# EAGLE design Stim+EMG-A2530 (EAGLE 7.1.0)
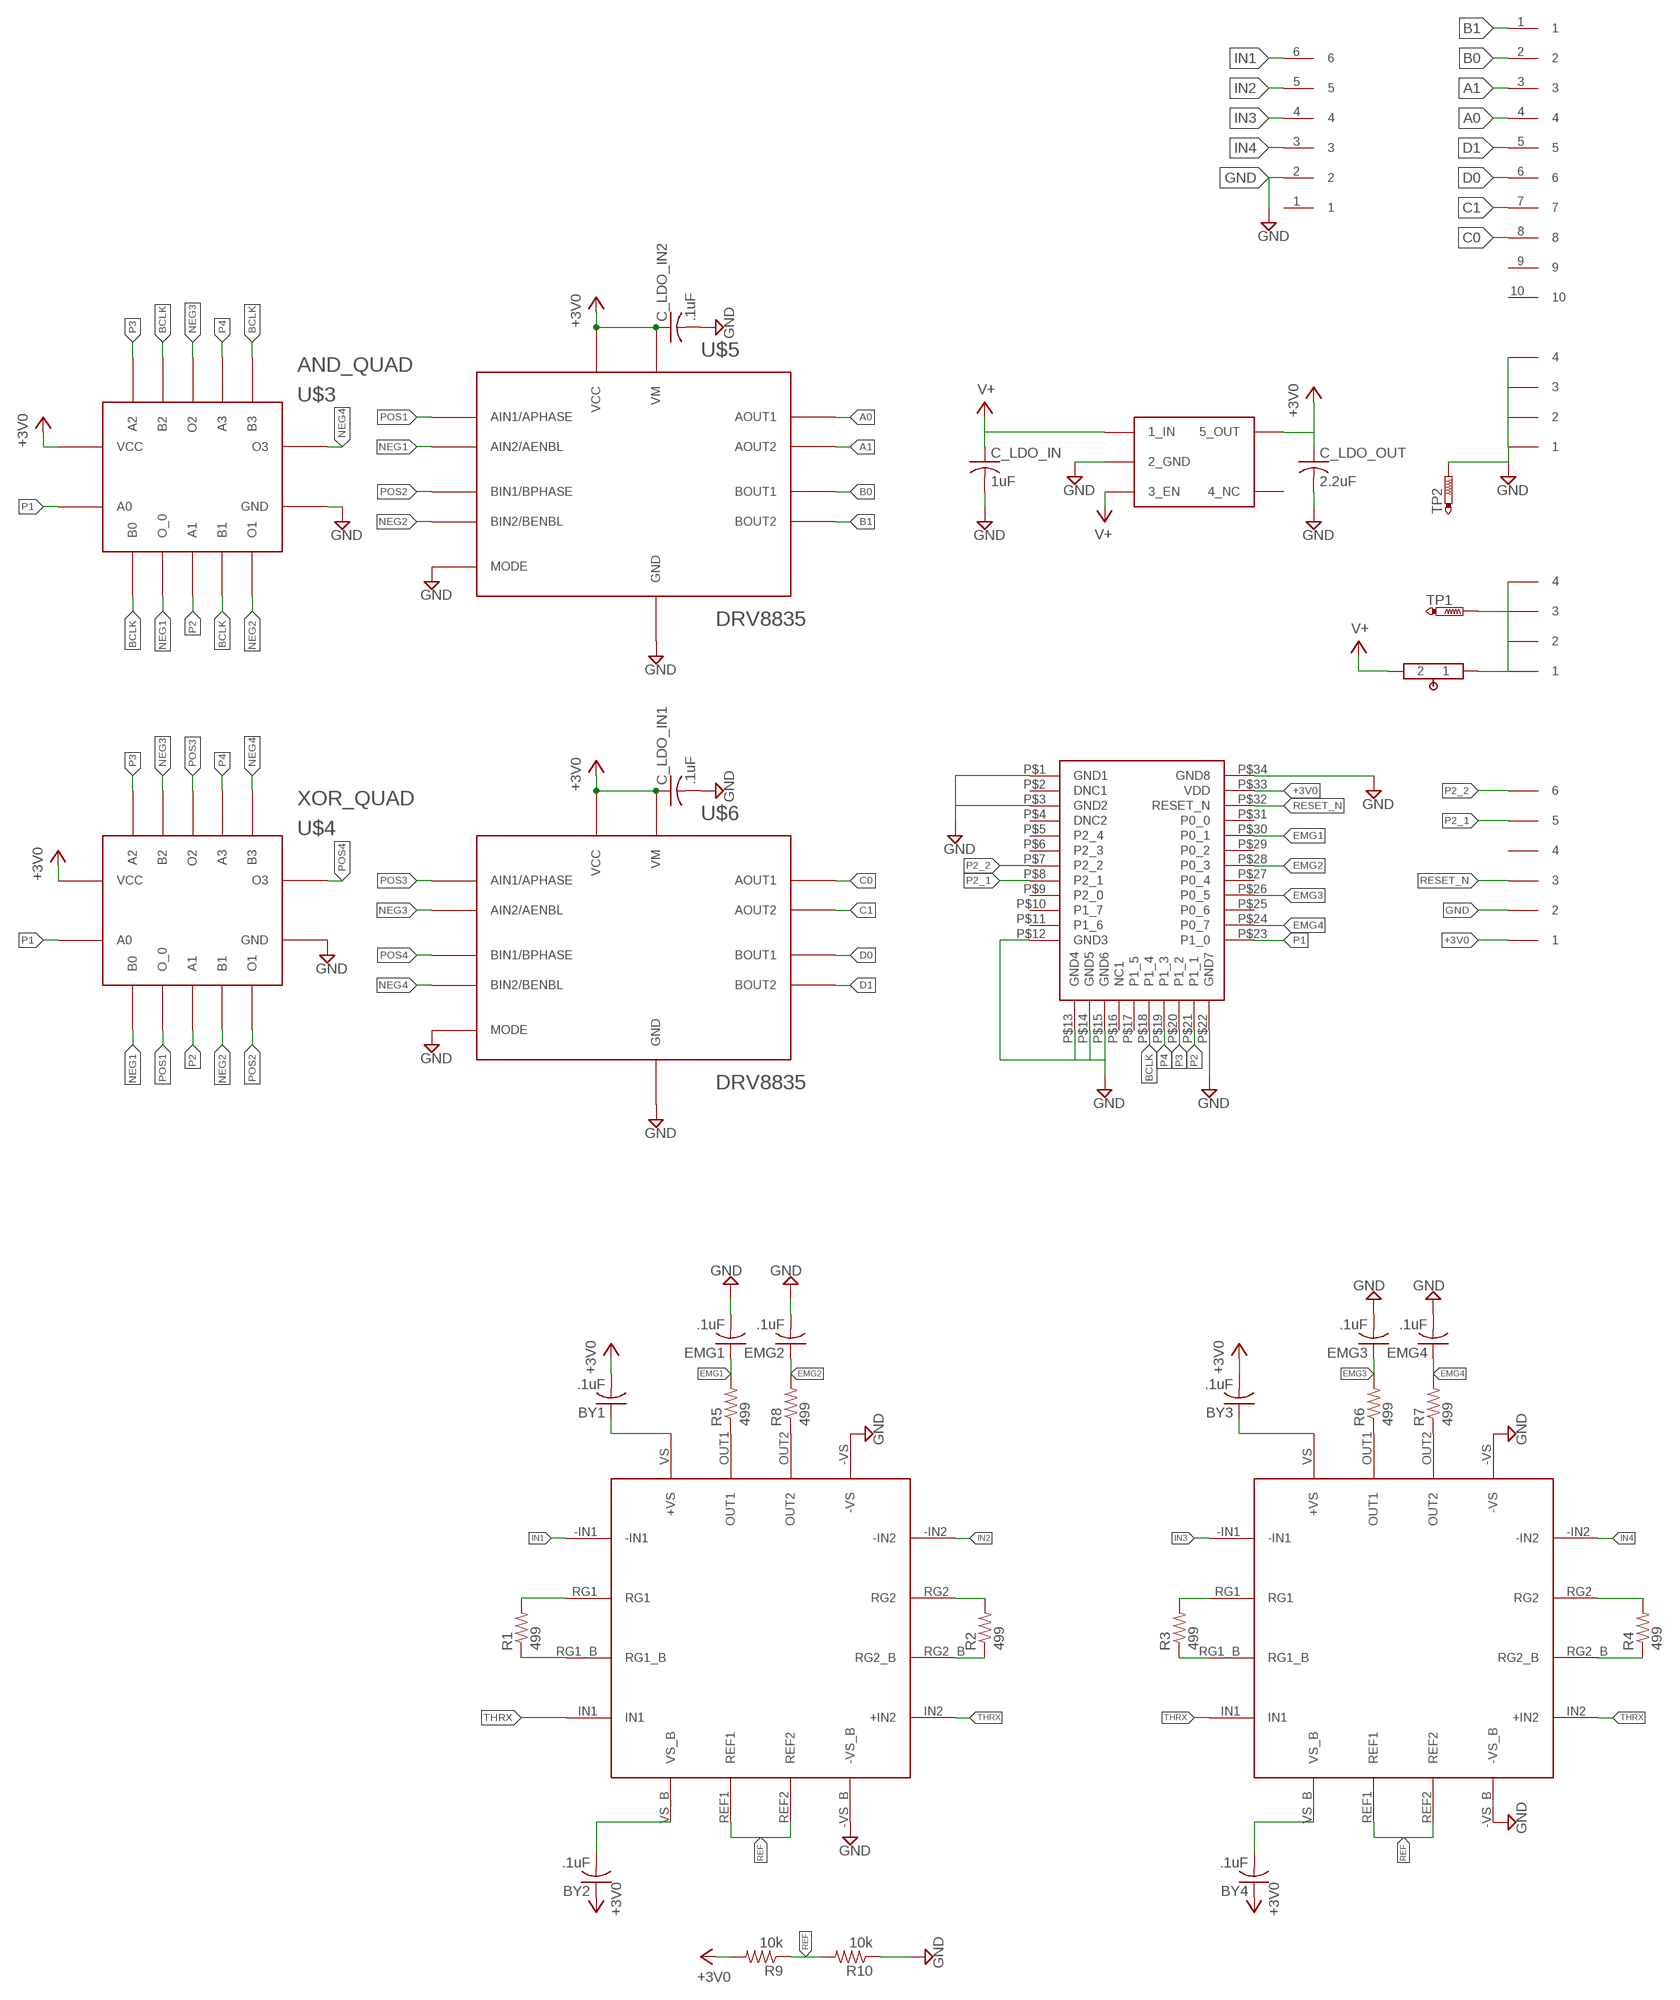
[diagram p0: schematic, sheet 1]

## Parts
BY1  .1uF  C-USC0603  [C0603]
BY2  .1uF  C-USC0603  [C0603]
BY3  .1uF  C-USC0603  [C0603]
BY4  .1uF  C-USC0603  [C0603]
C_LDO_IN  1uF  C-USC0603  [C0603]
C_LDO_IN1  .1uF  C-USC0603  [C0603]
C_LDO_IN2  .1uF  C-USC0603  [C0603]
C_LDO_OUT  2.2uF  C-USC0603  [C0603]
EMG1  .1uF  C-USC0603  [C0603]
EMG2  .1uF  C-USC0603  [C0603]
EMG3  .1uF  C-USC0603  [C0603]
EMG4  .1uF  C-USC0603  [C0603]
R1  499  R-US_R0402  [R0402]
R2  499  R-US_R0402  [R0402]
R3  499  R-US_R0402  [R0402]
R4  499  R-US_R0402  [R0402]
R5  499  R-US_R0402  [R0402]
R6  499  R-US_R0402  [R0402]
R7  499  R-US_R0402  [R0402]
R8  499  R-US_R0402  [R0402]
R9  10k  R-US_R0402  [R0402]
R10  10k  R-US_R0402  [R0402]
TP1  PTR1B2,54  [B2,54]
TP2  PTR1B2,54  [B2,54]
U$1  A2530  [A2530]
U$2  FFC6POS  [FFC6POS]
U$3  AND_QUAD  [QFN-14]
U$4  XOR_QUAD  [QFN-14]
U$5  DRV8835  [QFN-12-HEATSINK]
U$6  DRV8835  [QFN-12-HEATSINK]
U$7  FFC4POS  [FFC4POS]
U$8  FFC4POS  [FFC4POS]
U$9  AD8222  [QFN-16]
U$10  AD8222  [QFN-16]
U$11  FFC10POS  [FFC10POS]
U$12  FFC6POS  [FFC6POS]
U$18  SWITCH_MANUAL  [SWITCH_MANUAL]
VREG1  REGULATOR  [REGULATOR]

## Nets
+3V0: C_LDO_OUT.1 U$1.P$33(VDD) U$2.1 VREG1.5(5_OUT)
+3V3: BY1.2 BY2.1 BY3.2 BY4.1 C_LDO_IN1.1 C_LDO_IN2.1 R9.2 U$3.VCC U$4.VCC U$5.VCC U$5.VM U$6.VCC U$6.VM ; supply symbol labelled +3V0
A0: U$5.AOUT1 U$11.4
A1: U$5.AOUT2 U$11.3
B0: U$5.BOUT1 U$11.2
B1: U$5.BOUT2 U$11.1
BCLK: U$1.P$18(P1_4) U$3.B0 U$3.B1 U$3.B2 U$3.B3
C0: U$6.AOUT1 U$11.8
C1: U$6.AOUT2 U$11.7
D0: U$6.BOUT1 U$11.6
D1: U$6.BOUT2 U$11.5
EMG1: EMG1.1 R5.2 U$1.P$30(P0_1)
EMG2: EMG2.1 R8.2 U$1.P$28(P0_3)
EMG3: EMG3.1 R6.2 U$1.P$26(P0_5)
EMG4: EMG4.1 R7.2 U$1.P$24(P0_7)
GND: C_LDO_IN1.2 C_LDO_IN2.2 C_LDO_IN.2 C_LDO_OUT.2 EMG1.2 EMG2.2 EMG3.2 EMG4.2 R10.1 TP2.TP U$1.P$1(GND1) U$1.P$3(GND2) U$1.P$12(GND3) U$1.P$13(GND4) U$1.P$14(GND5) U$1.P$15(GND6) U$1.P$22(GND7) U$1.P$34(GND8) U$2.2 U$3.GND U$4.GND U$5.GND U$5.MODE U$6.GND U$6.MODE U$8.1 U$8.2 U$8.3 U$8.4 U$9.-VS U$9.-VS_B U$10.-VS U$10.-VS_B U$12.2 VREG1.2(2_GND)
IN1: U$9.-IN1 U$12.6
IN2: U$9.-IN2 U$12.5
IN3: U$10.-IN1 U$12.4
IN4: U$10.-IN2 U$12.3
N$1: R1.2 U$9.RG1
N$2: R1.1 U$9.RG1_B
N$3: R2.2 U$9.RG2
N$4: TP1.TP U$7.1 U$7.2 U$7.3 U$7.4 U$18.1
N$5: R2.1 U$9.RG2_B
N$6: R3.2 U$10.RG1
N$7: R3.1 U$10.RG1_B
N$8: R4.2 U$10.RG2
N$9: R4.1 U$10.RG2_B
N$10: R5.1 U$9.OUT1
N$11: R8.1 U$9.OUT2
N$12: R6.1 U$10.OUT1
N$13: R7.1 U$10.OUT2
N$14: BY1.1 U$9.VS(+VS)
N$15: BY3.1 U$10.VS(+VS)
N$16: BY4.2 U$10.VS_B
N$17: BY2.2 U$9.VS_B
NEG1: U$3.O_0 U$4.B0 U$5.AIN2.AENBL(AIN2/AENBL)
NEG2: U$3.O1 U$4.B1 U$5.BIN2/BENBL
NEG3: U$3.O2 U$4.B2 U$6.AIN2.AENBL(AIN2/AENBL)
NEG4: U$3.O3 U$4.B3 U$6.BIN2/BENBL
P1: U$1.P$23(P1_0) U$3.A0 U$4.A0
P2: U$1.P$21(P1_1) U$3.A1 U$4.A1
P2_1: U$1.P$8(P2_1) U$2.5
P2_2: U$1.P$7(P2_2) U$2.6
P3: U$1.P$20(P1_2) U$3.A2 U$4.A2
P4: U$1.P$19(P1_3) U$3.A3 U$4.A3
POS1: U$4.O_0 U$5.AIN1/APHASE
POS2: U$4.O1 U$5.BIN1/BPHASE
POS3: U$4.O2 U$6.AIN1/APHASE
POS4: U$4.O3 U$6.BIN1/BPHASE
REF: R9.1 R10.2 U$9.REF1 U$9.REF2 U$10.REF1 U$10.REF2
RESET_N: U$1.P$32(RESET_N) U$2.3
THRX: U$9.IN1 U$9.IN2(+IN2) U$10.IN1 U$10.IN2(+IN2)
V+: C_LDO_IN.1 U$18.2 VREG1.1(1_IN) VREG1.3(3_EN)
Unconnected: U$1.P$2(DNC1) U$1.P$4(DNC2) U$1.P$5(P2_4) U$1.P$6(P2_3) U$1.P$9(P2_0) U$1.P$10(P1_7) U$1.P$11(P1_6) U$1.P$16(NC1) U$1.P$17(P1_5) U$1.P$25(P0_6) U$1.P$27(P0_4) U$1.P$29(P0_2) U$1.P$31(P0_0) U$2.4 U$11.9 U$11.10 U$12.1 VREG1.4(4_NC)

## Library data of the parts
BY1-BY4 C_LDO_IN C_LDO_IN1 C_LDO_IN2 C_LDO_OUT EMG1-EMG4 = resistor:C-US: CAPACITOR, American symbol
R1-R10 = adafruit:R-US_: RESISTOR, American symbol
TP1 TP2 = testpad:PTR1: TEST PIN
U$1 = CC2530_PCB_TL:A2530
U$2 = CC2530_PCB_TL:FFC6POS: FFC Connector 6POS
U$3 = kushal:AND_QUAD: Quad package SMD AND chip
U$4 = kushal:XOR_QUAD: Quad package SMD XOR
U$5 U$6 = kushal:DRV8835: DRV8835 dual package motor driver H bridge
U$7 U$8 = CC2530_PCB_TL:FFC4POS: FFC COnnector 4POS
U$9 U$10 = kushal:AD8222
U$11 = CC2530_PCB_TL:FFC10POS: FFC Connector 10POS
U$12 = iBionics:FFC6POS: FFC Connector 6POS
U$18 = CC2530_PCB_TL:SWITCH_MANUAL
VREG1 = CC2530_PCB_TL:REGULATOR: IC REG LDO 3V 50MA SOT23-5 TPS76030DBVT

## Board
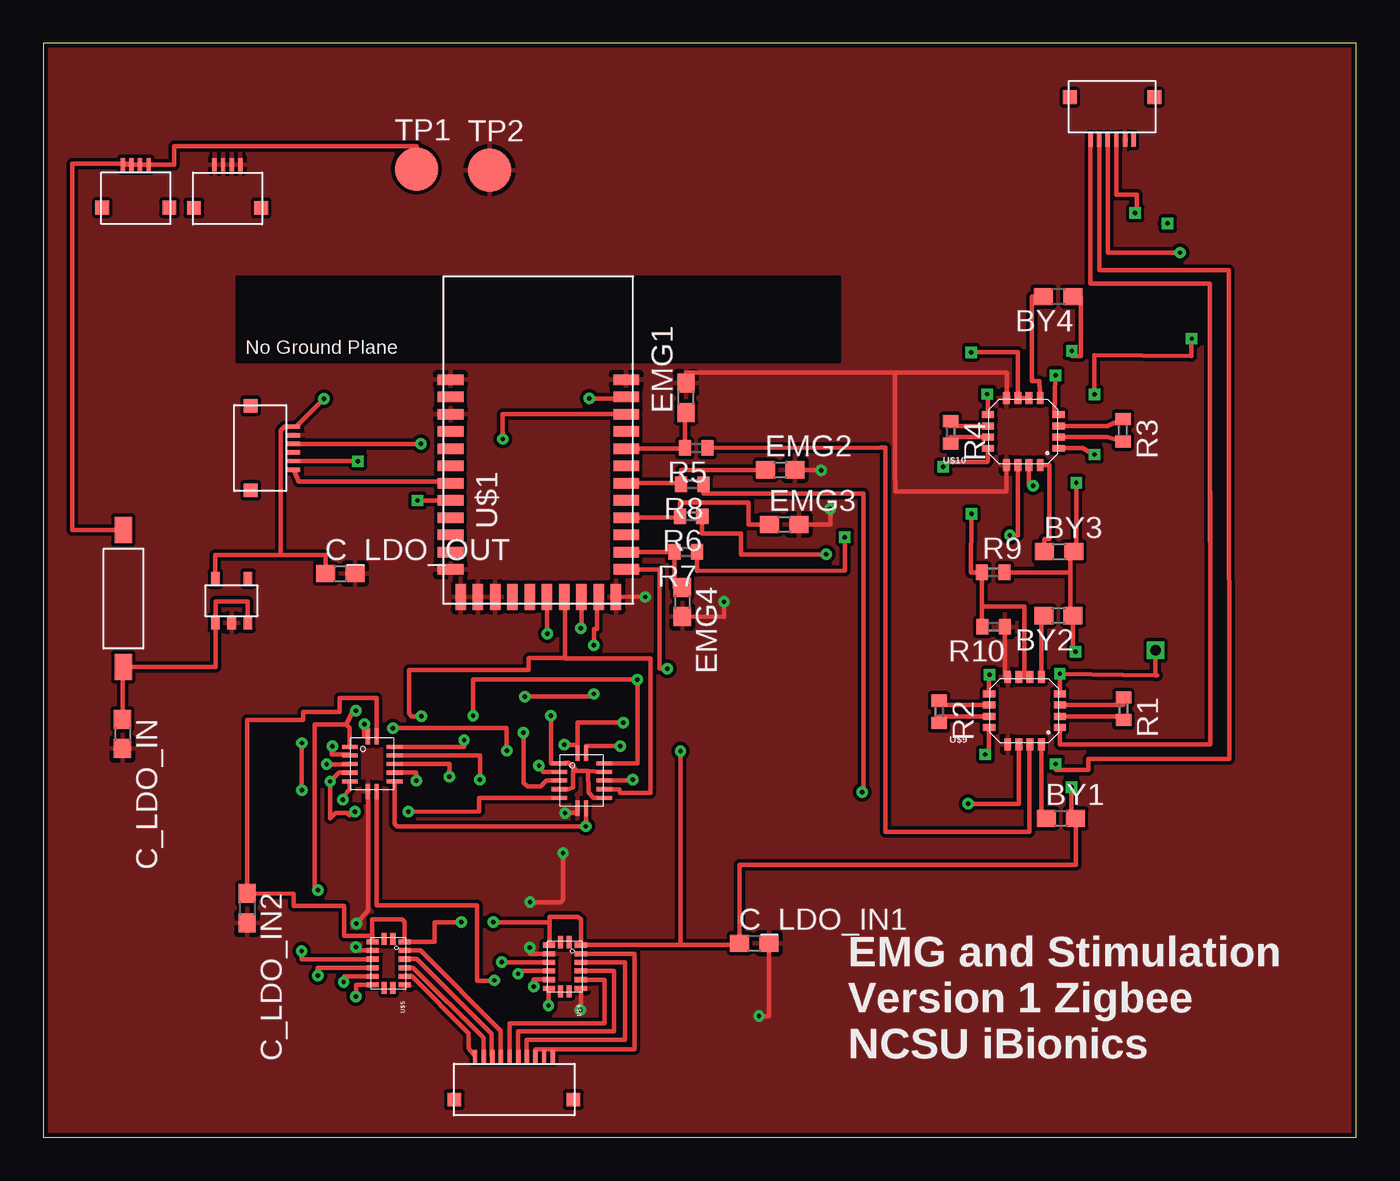
[diagram p1: board, top side]
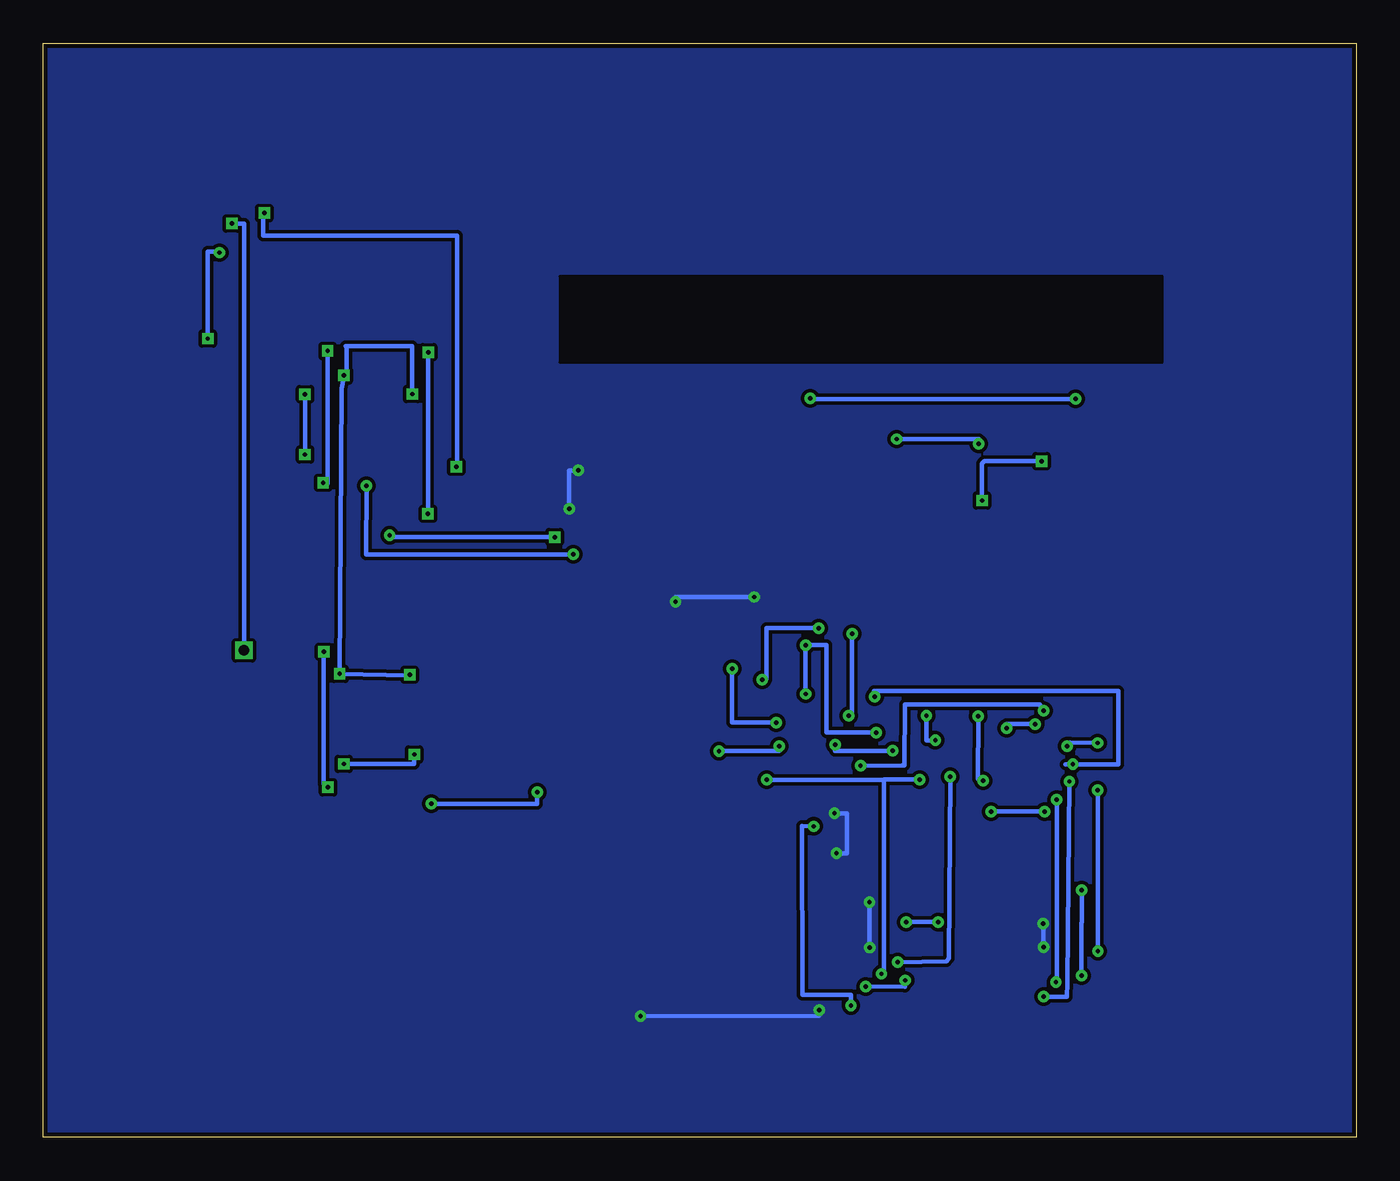
[diagram p2: board, bottom side, seen from below]

Size 76.2 x 63.5 mm. Coordinates in mm from the lower left corner, seen from the top.
Outline: 0,0 76.2,0 76.2,63.5 0,63.5 0,0
Copper layers (1*16): Top 0.035mm / dielectric 1.5mm / Bottom 0.035mm
Design rules "4pcb": minimum track width 8mil, minimum drill 10mil, track to track 8mil, track to pad 8mil, pad to pad 8mil, via to via 8mil, smd to smd 8mil, copper to edge 10mil, drill to drill 8mil, minimum pad ring 10mil, minimum via ring 8mil, stop-mask expansion 4mil, vias tented up to drill 0mil, thermal gap 10mil

### Footprints (pad centres in the part's own frame; a part is rotated, then mirrored left to right if it is on the bottom)
C0603 = smd 1.1 x 1: 1 -0.85,0; 2 0.85,0
R0402 = smd 0.7 x 0.9: 1 -0.65,0; 2 0.65,0
B2,54 = smd 2.54 x 2.54: TP 0,0
A2530 = smd 1.5 x 0.61: P$1 -5.1,0; P$2 -5.1,-1; P$3 -5.1,-2; P$4 -5.1,-3; P$5 -5.1,-4; P$6 -5.1,-5; P$7 -5.1,-6; P$8 -5.1,-7; P$9 -5.1,-8; P$10 -5.1,-9; P$11 -5.1,-10; P$12 -5.1,-11; P$23 5.1,-11; P$24 5.1,-10; P$25 5.1,-9; P$26 5.1,-8; P$27 5.1,-7; P$28 5.1,-6; P$29 5.1,-5; P$30 5.1,-4; P$31 5.1,-3; P$32 5.1,-2; P$33 5.1,-1; P$34 5.1,0 | smd 0.61 x 1.5: P$13 -4.5,-12.6; P$14 -3.5,-12.6; P$15 -2.5,-12.6; P$16 -1.5,-12.6; P$17 -0.5,-12.6; P$18 0.5,-12.6; P$19 1.5,-12.6; P$20 2.5,-12.6; P$21 3.5,-12.6; P$22 4.5,-12.6
FFC6POS = smd 0.762 x 0.254: 1 0.008,1.269; 2 0.008,0.769; 3 0.008,0.269; 4 0.008,-0.231; 5 0.008,-0.731; 6 0.008,-1.231 | smd 0.8 x 0.8: P$7 -2.49,2.47; P$8 -2.49,-2.43
QFN-14 = smd 0.9 x 0.24: A0 -1.6,-0.25; GND 1.6,-0.25; O3 1.6,0.25; VCC -1.6,0.25 | smd 0.24 x 0.9: A1 0,-1.3; A2 -1,1.3; A3 0.5,1.3; B0 -1,-1.3; B1 0.5,-1.3; B2 -0.5,1.3; B3 1,1.3; O1 1,-1.3; O2 0,1.3; O_0 -0.5,-1.3; P$11 -1,-1.3
QFN-12-HEATSINK = smd 0.3 x 0.7: AIN1/APHASE -0.25,-0.925; AIN2.AENBL 0.25,-0.925; AOUT1 -0.75,0.925; AOUT2 -0.25,0.925; BIN1/BPHASE 0.75,-0.925; BIN2/BENBL 1.25,-0.925; BOUT1 0.25,0.925; BOUT2 0.75,0.925; GND 1.25,0.925; MODE -0.75,-0.925; VCC -1.25,-0.925; VM -1.25,0.925 | smd 0.7 x 0.3: P$13 -1.425,0.25; P$14 -1.425,-0.25; P$15 1.425,0.25; P$16 1.425,-0.25
FFC4POS = smd 0.762 x 0.254: 1 0.04,0.742; 2 0.04,0.242; 3 0.04,-0.258; 4 0.04,-0.758 | smd 0.8 x 0.8: P$5 -2.46,1.94; P$6 -2.46,-1.96
QFN-16 = smd 0.7 x 0.4: -IN1 -2.05,0.975; -IN2 2.05,0.975; IN1 -2.05,-0.975; IN2 2.05,-0.975; RG1 -2.05,0.325; RG1_B -2.05,-0.325; RG2 2.05,0.325; RG2_B 2.05,-0.325 | smd 0.4 x 0.7: -VS 0.975,1.95; -VS_B 0.975,-1.95; OUT1 -0.325,1.95; OUT2 0.325,1.95; REF1 -0.325,-1.95; REF2 0.325,-1.95; VS -0.975,1.95; VS_B -0.975,-1.95
FFC10POS = smd 0.762 x 0.254: 1 -0.015,2.271; 2 -0.015,1.771; 3 -0.015,1.271; 4 -0.015,0.771; 5 -0.015,0.271; 6 -0.015,-0.229; 7 -0.015,-0.729; 8 -0.015,-1.229; 9 -0.015,-1.729; 10 -0.015,-2.229 | smd 0.8 x 0.8: P$11 -2.52,3.47; P$12 -2.52,-3.43
SWITCH_MANUAL = smd 1.524 x 1.016: 1 -4.13,0; 2 3.81,0
REGULATOR = smd 0.5 x 0.8: 1 0.94,1.275; 2 0,1.275; 3 -0.95,1.275; 4 -0.95,-1.275; 5 0.95,-1.275

### Placement (x,y rotation side)
BY1  59.05,18.51 0 top
BY2  58.91,30.27 180 top
BY3  58.95,34 0 top
BY4  58.9,48.79 180 top
C_LDO_IN  4.61,23.41 270 top
C_LDO_IN1  41.26,11.27 0 top
C_LDO_IN2  11.84,13.3 270 top
C_LDO_OUT  17.24,32.72 0 top
EMG1  37.31,42.92 90 top
EMG2  42.77,38.73 0 top
EMG3  43,35.57 0 top
EMG4  37.09,31.07 270 top
R1  62.68,24.87 270 top
R2  51.99,24.69 270 top
R3  62.65,41.03 270 top
R4  52.65,40.91 270 top
R5  37.89,40.01 180 top
R6  37.59,36.04 180 top
R7  37.28,33.98 180 top
R8  37.67,37.9 180 top
R9  55.13,32.79 0 top
R10  55.16,29.63 180 top
TP1  21.67,56.19 0 top
TP2  25.92,56.13 0 top
U$1  28.74,43.96 0 top
U$2  14.54,39.98 0 top
U$3  31.25,20.71 270 top
U$4  19.1,21.67 270 top
U$5  20.05,10.1 270 top
U$6  30.27,9.91 270 top
U$7  5.37,56.41 90 top
U$8  10.69,56.4 90 top
U$9  56.94,24.76 180 top
U$10  56.87,40.96 180 top
U$11  27.34,4.72 90 top
U$12  62,57.87 270 top
U$18  4.66,31.11 270 top
VREG1  10.94,31.14 180 top

### Tracks (layer width: path | path; a pad name or v marks a point on that pad's centre or on a via)
+3V0  (via drill 0.25)
  Top 0.254: 13.77,33.81 13.77,41.02 14,41.25 14.46,41.25 U$2.1 14.69,41.25 v16.29,42.85 | v31.68,42.88 33.84,42.88 U$1.P$33 | VREG1.5 9.99,33.81 13.77,33.81 | C_LDO_OUT.1 16.39,33.81 13.77,33.81
  Bottom 0.254: v16.29,42.85 31.68,42.85 v31.68,42.88
+3V3  (via drill 0.25)
  Top 0.254: 29.39,12.49 29.39,11.2 U$6.VCC | 59.59,32.79 59.59,30.27 BY2.1 59.76,28.18 v59.91,28.18 | 59.96,34.12 v59.95,37.98 | v59.67,20.32 59.67,18.51 BY1.2 59.92,18.51 59.92,15.82 40.41,15.82 C_LDO_IN1.1 40.41,11.16 36.98,11.16 | R9.2 59.59,32.79 | BY3.2 59.96,34.12 | 59.96,34.12 59.59,34.17 59.59,32.79 | BY4.1 60.2,48.79 60.2,45.34 59.68,45.34 v59.69,45.63 | v24.27,12.5 24.14,12.48 22.7,12.48 22.7,11.35 U$5.VM 20.97,12.5 20.82,12.65 19.08,12.65 19.08,11.39 U$5.VCC 19.12,11.71 17.47,11.71 17.47,13.45 14.54,13.45 14.54,14.12 C_LDO_IN2.1 11.84,24.22 15.09,24.22 15.09,24.68 17.21,24.68 17.21,25.51 19.25,25.51 19.35,25.51 19.35,25.41 U$4.VCC | v26.12,12.49 29.39,12.49 | 29.39,12.49 29.39,12.79 31.05,12.79 31.2,12.64 U$6.VM 36.98,11.16 | U$3.VCC 31.5,22.71 v33.49,22.71 | v36.98,22.42 36.98,11.16
  Bottom 0.254: v59.95,37.98 59.68,37.94 v59.69,45.63 | v59.67,20.32 59.91,20.51 v59.91,28.18 | v24.27,12.5 26.12,12.5 v26.12,12.49 | v33.49,22.71 33.49,22.42 v36.98,22.42
A0
  Top 0.254: U$5.AOUT1 21.89,10.85 26.55,6.2 26.55,4.73 U$11.4
A1
  Top 0.254: U$5.AOUT2 21.68,10.35 26.02,6.01 26.02,4.75 U$11.3
B0
  Top 0.254: U$5.BOUT1 21.48,9.85 25.55,5.78 25.55,4.73 U$11.2
B1
  Top 0.254: U$5.BOUT2 21.37,9.37 24.69,6.05 24.69,5.16 U$11.1
BCLK  (via drill 0.25 pad 0.25)
  Top 0.254: 32.58,21.21 U$3.B2 32.38,21.2 31.63,21.28 | 31.63,21.28 30.74,21.28 | 30.74,21.28 30.89,21.35 30.46,21.75 U$3.B0 29.47,21.71 v29.47,24.48 | U$3.B1 30.45,20.21 30.74,20.32 30.74,21.28 | U$3.B3 31.95,19.71 31.66,20.01 31.63,21.28 | v29.26,29.24 29.23,29.24 U$1.P$18
  Bottom 0.254: v29.47,24.48 29.26,24.48 v29.26,29.24
C0
  Top 0.254: U$11.8 28.57,5.12 34.32,5.12 34.32,10.66 U$6.AOUT1
C1
  Top 0.254: U$11.7 28.07,5.66 33.76,5.66 33.76,10.16 U$6.AOUT2
D0
  Top 0.254: U$11.6 27.57,6.14 33.13,6.14 33.13,9.66 U$6.BOUT1
D1
  Top 0.254: U$6.BOUT2 31.2,9.14 32.59,9.16 32.59,6.63 27.08,6.62 27.08,4.71 U$11.5
EMG1
  Top 0.254: U$1.P$30 37.24,39.97 R5.2 37.24,42.07 EMG1.1
EMG2
  Top 0.254: U$1.P$28 37.02,37.97 R8.2 37.02,38.73 EMG2.1
EMG3
  Top 0.254: U$1.P$26 36.95,35.97 R6.2 36.95,36.85 40.93,36.85 40.93,35.57 EMG3.1
EMG4
  Top 0.254: U$1.P$24 36.63,33.97 R7.2 36.63,31.92 EMG4.1
GND  (via drill 0.25 pad 0.25)
  Top 0.254: U$3.GND 31,18.98 30.85,18.83 v30.29,18.83 | v30.17,16.49 30.17,13.8 30.02,13.65 v28.25,13.65 | 28.36,10.9 v28.25,11.01 28.25,10.66 U$6.MODE | U$4.GND 18.85,13.17 v18.17,12.41 | U$5.MODE 18.14,10.84 v18.14,11.04 | U$9.-VS_B 55.81,26.71 R10.1 | U$10.-VS_B 55.91,44.39 49.44,44.39 | U$10.-VS 55.9,37.49 49.45,37.49 49.45,38.15 49.44,38.15 49.44,44.39 | EMG1.2 37.31,44.39 49.44,44.39 | v39.51,31.08 39.52,30.21 EMG4.2 | U$6.GND 31.2,7.26 v31.18,7.4 | v41.54,7.04 42.11,7.04 C_LDO_IN1.2 | EMG2.2 45.14,38.73 v45.14,38.71 | v45.68,36.48 45.68,35.57 EMG3.2 | U$1.P$22 34.53,31.38 v34.94,31.36
  Bottom 0.254: v30.17,16.49 30.21,16.48 29.55,16.48 29.55,18.79 30.44,18.79 v30.29,18.83 | v28.25,13.65 28.25,10.81 v28.25,11.01 | v18.17,12.41 18.17,10.92 v18.14,11.04 | v31.18,7.4 31.18,7.05 v41.54,7.04 | v45.14,38.71 45.68,38.71 v45.68,36.48 | v34.94,31.36 39.51,31.35 v39.51,31.08
  pour Top: 0,63.5 76.2,63.5 76.2,0 0,0
  pour Bottom: 0,63.5 76.2,63.5 76.2,0 0,0
IN1
  Top 0.254: 67.73,37.49 67.73,34.56 | 67.73,34.56 67.73,22.81 58.99,22.81 U$9.-IN1 | 67.73,34.56 67.71,34.56 67.71,49.53 60.77,49.53 U$12.6
IN2  (via drill 0.25)
  Top 0.254: v58.76,21.67 58.77,21.32 60.65,21.32 60.65,21.97 68.82,21.97 68.79,42.74 68.79,50.33 61.27,50.33 U$12.5 | v54.67,22.23 54.89,22.23 U$9.-IN2
  Bottom 0.254: v58.76,21.67 54.67,21.67 v54.67,22.23
IN3  (via drill 0.25)
  Top 0.254: v61.01,43.13 61,43.37 61,45.41 66.63,45.33 66.63,46.35 v66.65,46.35 | v61.01,39.62 60.3,39.99 U$10.-IN1 | U$12.4 61.77,51.34 v65.97,51.34
  Bottom 0.254: v61.01,43.13 v61.01,39.62 | v66.65,46.35 66.65,51.4 65.97,51.4 v65.97,51.34
IN4  (via drill 0.25)
  Top 0.254: v52.23,38.91 52.52,39.2 54.76,39.2 54.82,39.26 U$10.-IN2 | U$12.3 62.27,54.71 63.46,54.71 63.46,53.64 v63.37,53.64
  Bottom 0.254: v52.23,38.91 52.18,38.91 52.18,52.32 63.42,52.32 63.42,53.64 v63.37,53.64
N$1
  Top 0.254: R1.2 62.68,24.44 U$9.RG1
N$2
  Top 0.254: R1.1 62.68,25.09 U$9.RG1_B
N$3
  Top 0.254: R2.2 51.99,24.44 U$9.RG2
N$4
  Top 0.254: U$18.1 1.69,35.24 1.69,56.51 5.12,56.51 U$7.2 | U$7.2 U$7.3 U$7.4 7.62,56.45 7.62,57.51 21.67,57.51 TP1.TP | U$7.2 U$7.1
N$5
  Top 0.254: R2.1 51.99,25.09 U$9.RG2_B
N$6
  Top 0.254: R3.2 61.76,40.64 U$10.RG1
N$7
  Top 0.254: R3.1 61.76,41.29 U$10.RG1_B
N$8
  Top 0.254: R4.2 52.65,40.64 U$10.RG2
N$9
  Top 0.254: R4.1 52.65,41.29 U$10.RG2_B
N$10
  Top 0.254: R5.1 48.6,40.02 48.88,40.02 48.88,17.72 57.23,17.72 57.23,22.81 U$9.OUT1
N$11  (via drill 0.25)
  Top 0.254: 56.53,22.81 U$9.OUT2 56.61,19.36 v53.67,19.36 | R8.1 38.32,37.38 47.59,37.38 47.59,20.04 v47.53,20.04
  Bottom 0.254: v47.53,20.04 47.53,19.36 v53.67,19.36
N$12  (via drill 0.25, 0.25 pad 0.25)
  Top 0.254: U$10.OUT1 57.2,37.82 v57.44,37.82 | R6.1 38.24,35.04 40.49,35.04 40.49,33.83 v45.43,33.83
  Bottom 0.254: v57.44,37.82 57.46,33.83 49.33,33.83 49.12,33.83 v45.43,33.83
N$13  (via drill 0.25, 0.25 pad 0.25)
  Top 0.254: 37.94,34.19 R7.1 37.94,32.87 46.52,32.9 v46.52,34.83 | U$10.OUT2 56.55,34.94 v56.1,34.94
  Bottom 0.254: v46.52,34.83 56.1,34.83 v56.1,34.94
N$14
  Top 0.254: BY1.1 57.91,18.51 U$9.VS
N$15
  Top 0.254: 57.85,34.17 BY3.1 58.1,34.73 58.4,34.73 58.4,39.01 U$10.VS
N$16
  Top 0.254: U$10.VS_B 57.84,43.56 57.81,43.58 57.81,43.88 57.38,43.88 57.38,48.79 BY4.2
N$17
  Top 0.254: BY2.2 57.91,30.27 U$9.VS_B
NEG1  (via drill 0.25 pad 0.25)
  Top 0.254: U$5.AIN2.AENBL 19.02,9.83 15.94,9.83 v15.94,9.4 | v18.14,24.77 18,24.74 17.59,23.96 | v28.77,21.56 28.99,21.21 U$3.O_0 | U$4.B0 17.8,23.76 17.59,23.96 | 17.59,23.96 16.43,23.96 15.74,23.97 15.74,14.54 v15.94,14.36
  Bottom 0.254: v18.14,24.77 18.24,24.77 18.35,25.13 26.19,25.13 26.22,21.57 26.36,21.57 v28.77,21.56 | v15.94,9.4 v15.95,9.41 15.95,12.44 15.94,12.48 v15.94,14.36
NEG2  (via drill 0.25 pad 0.25)
  Top 0.254: U$5.BIN2/BENBL 18.15,8.85 v18.14,8.17 | v18.08,18.91 17.77,18.67 17.62,18.83 16.99,18.83 16.66,18.52 v16.66,20.66 17.17,21.17 17.75,21.17 U$4.B1 | U$3.O1 25.29,19.71 25.29,18.91 21.03,18.9 v21.19,18.91
  Bottom 0.254: v18.14,8.17 16.79,8.17 16.78,8.96 v16.66,20.66 | v21.19,18.91 20.94,18.91 v18.08,18.91
NEG3  (via drill 0.25 pad 0.25)
  Top 0.254: U$6.AIN2.AENBL 27.56,9.66 v27.56,9.49 | v34.22,20.75 34.22,20.71 U$3.O2 | U$4.B2 25.34,22.17 v25.34,20.77
  Bottom 0.254: v27.56,9.49 27.4,9.49 27.4,20.75 | 27.4,20.75 v34.22,20.75 | v25.34,20.77 27.4,20.77 27.4,20.75
NEG4  (via drill 0.25 pad 0.25)
  Top 0.254: U$6.BIN2/BENBL 29.33,8.68 v29.33,7.65 | U$3.O3 31.49,19.09 v31.49,18.05 20.55,18.05 20.4,18.2 U$4.B3
  Bottom 0.254: v31.49,18.05 32.17,18.07 32.15,8.28 32.15,8.27 29.34,8.28 v29.33,7.65
P1  (via drill 0.25)
  Top 0.254: v20.3,23.75 26.9,23.75 v26.9,22.43 | v30.24,22.79 31,22.78 | U$3.A0 31,22.78 | 31,22.78 31,24.08 v33.67,24.08 | v36.22,27.2 35.77,27.2 35.77,32.96 U$1.P$23 | U$4.A0 18.64,23.27 v18.64,23.98
  Bottom 0.254: 20.3,23.72 v20.3,23.75 20.3,23.98 v18.64,23.98 | v26.9,22.43 30.25,22.43 v30.24,22.79 | v33.67,24.08 36.22,24.08 v36.22,27.2
P2  (via drill 0.25)
  Top 0.254: U$1.P$21 32.14,31.36 32.14,29.5 31.96,29.5 v31.96,28.57 | U$4.A1 17.8,21.64 v16.45,21.65 | v27.95,25.57 31.96,25.57 v31.96,25.73 | U$3.A1 29.2,20.71 28.85,20.36 28.1,20.36 27.88,20.57 27.88,23.48 v27.87,23.49
  Bottom 0.254: v27.87,23.49 30.75,23.49 30.75,28.57 v31.96,28.57 v31.96,25.73 | v16.45,21.65 16.89,21.65 13.81,21.65 13.81,25.91 27.99,25.91 27.99,25.57 v27.95,25.57
P2_1  (via drill 0.25)
  Top 0.254: U$2.5 v18.27,39.25 v18.27,39.24 | v21.73,36.95 23.62,36.95 U$1.P$8
  Bottom 0.254: v18.27,39.24 21.57,39.24 21.73,39.09 v21.73,36.95
P2_2
  Top 0.254: U$2.6 14.82,38.05 23.6,38.05 U$1.P$7
P3  (via drill 0.25)
  Top 0.254: U$3.A2 34.48,21.71 v34.48,26.57 24.95,26.57 v24.95,24.48 | v31.2,29.55 31.23,29.55 U$1.P$20 | U$4.A2 24.43,22.67 v24.43,23.04
  Bottom 0.254: v34.48,26.57 34.23,26.57 34.24,29.56 31.21,29.56 v31.2,29.55 | v24.43,23.04 24.95,23.04 v24.95,24.48
P4  (via drill 0.25 pad 0.25)
  Top 0.254: 28.2,27.81 28.2,27.78 | 28.2,27.81 28.17,27.78 28.17,27.13 21.24,27.13 21.24,24.59 21.39,24.44 v21.94,24.44 | v21.66,20.71 21.65,21.17 U$4.A3 | U$1.P$19 30.28,31.36 30.28,27.81 | 30.28,27.81 30.28,27.8 34.21,27.79 35.24,27.79 35.26,19.99 33.46,19.99 33.45,20.19 32.55,20.19 U$3.A3 | 28.2,27.81 30.28,27.81
  Bottom 0.254: v21.94,24.44 21.97,20.81 21.82,20.78 v21.66,20.71
POS1  (via drill 0.25 pad 0.25)
  Top 0.254: U$5.AIN1/APHASE 19,10.34 15.88,10.34 15,10.35 v15,10.81 | v15.01,22.89 15.01,20.18 v15.01,20.16 | v16.78,22.7 16.75,22.7 16.75,22.22 17.8,22.22 U$4.O_0
  Bottom 0.254: v16.78,22.7 16.78,22.76 16.63,22.91 v15.01,22.89 | v15.01,20.16 15.01,11.06 v15,10.81
POS2  (via drill 0.25 pad 0.25)
  Top 0.254: U$5.BIN1/BPHASE 17.46,9.36 v17.43,9.01 | v17.39,19.6 17.64,20.05 17.8,20.21 U$4.O1
  Bottom 0.254: v17.43,9.01 17.39,9.06 v17.39,19.6
POS3  (via drill 0.25 pad 0.25)
  Top 0.254: U$4.O2 23.58,21.67 v23.57,20.93 | v26.63,10.16 27.67,10.16 U$6.AIN1/APHASE
  Bottom 0.254: v23.57,20.93 23.65,10.38 23.8,10.23 v26.63,10.16
POS4  (via drill 0.25 pad 0.25)
  Top 0.254: U$4.O3 19.35,17.45 19.36,13.46 25.18,13.46 25.18,9.08 26.19,9.08 v26.19,9.11 | v28.48,8.76 28.47,9.16 U$6.BIN1/BPHASE
  Bottom 0.254: v26.19,9.11 26.19,9.14 26.2,8.74 v28.48,8.76
REF  (via drill 0.25)
  Top 0.254: R10.2 54.48,29.63 54.48,30.82 | 54.48,30.82 R9.1 53.83,32.79 v53.87,36.19 | U$9.REF1 U$9.REF2 56.93,26.71 56.93,30.82 54.48,30.82 | v53.85,45.56 56.56,45.56 U$10.REF2 U$10.REF1
  Bottom 0.254: v53.87,36.2 v53.87,36.19 v53.85,45.56
RESET_N  (via drill 0.25)
  Top 0.254: U$1.P$32 26.67,41.97 v26.67,40.52 | v21.92,40.24 14.54,40.24 U$2.3
  Bottom 0.254: v26.67,40.52 21.92,40.52 v21.92,40.24
THRX  (via drill 0.25, 0.6)
  Top 0.254: U$10.IN2 54.82,43.13 v54.78,43.13 | v58.75,44.21 58.68,41.94 U$10.IN1 | U$9.IN1 58.99,26.81 v58.99,26.9 64.54,26.81 | U$9.IN2 54.89,26.85 v54.93,26.85 | v64.54,28.27 64.54,26.81 | 64.54,26.81 64.66,26.81 | 65.01,53.03 v65.25,53.03
  Bottom 0.254: v54.93,26.85 54.93,26.81 v58.99,26.9 58.89,43.44 v58.75,44.21 58.59,44.21 58.59,45.91 | v64.54,28.27 64.54,53.03 v65.25,53.03 | v54.78,43.13 54.78,45.91 58.59,45.91 | 58.59,45.91 58.66,45.91
V+
  Top 0.254: VREG1.3 11.87,29.86 11.87,31.09 10,31.09 VREG1.1 10,27.3 U$18.2 4.61,27.3 C_LDO_IN.1

### Text on the board
tPlace: EMG and Stimulation / Version 1 Zigbee / NCSU iBionics